# EAGLE design esp_LedControl_signal (EAGLE 9.5.2)
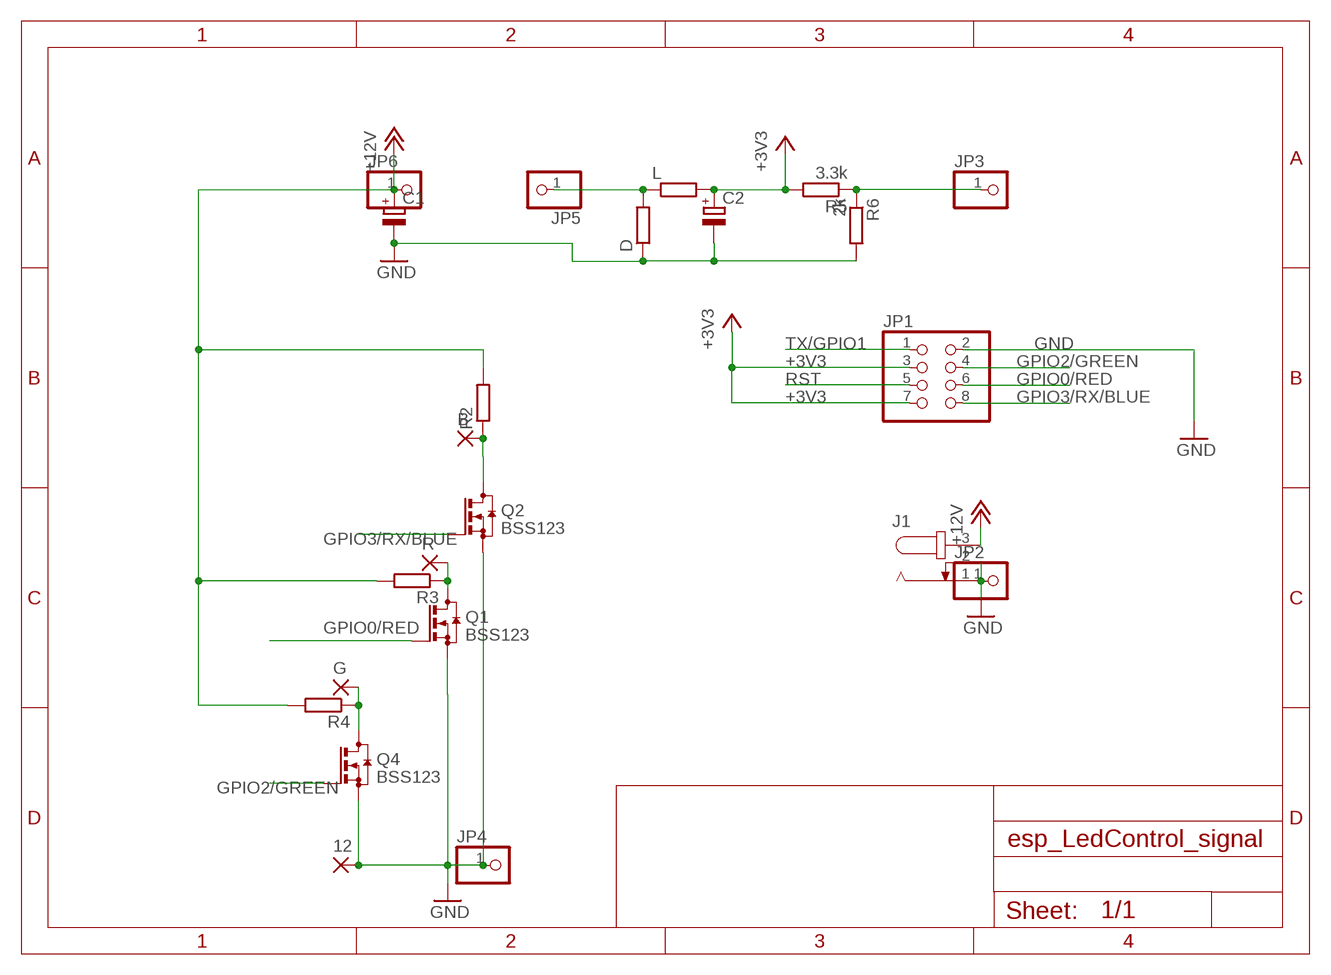
[diagram p0: schematic, sheet 1]

## Parts
12  3,17/1,3  [3,17/1,3]
B  3,17/1,3  [3,17/1,3]
C1  CPOL-EUE2.5-5  [E2,5-5]
C2  CPOL-EUE2.5-5  [E2,5-5]
D  R-EU_0204/7  [0204/7]
G  3,17/1,3  [3,17/1,3]
J1  JACK-PLUG0  [SPC4077]
JP1  PINHD-2X4  [2X04]
JP2  PINHD-1X1  [1X01]
JP3  PINHD-1X1  [1X01]
JP4  PINHD-1X1  [1X01]
JP5  PINHD-1X1  [1X01]
JP6  PINHD-1X1  [1X01]
L  R-EU_0204/7  [0204/7]
Q1  BSS123  [SOT23]
Q2  BSS123  [SOT23]
Q4  BSS123  [SOT23]
R  3,17/1,3  [3,17/1,3]
R2  R-EU_R0805  [R0805]
R3  R-EU_R0805  [R0805]
R4  R-EU_R0805  [R0805]
R5  3.3k  R-EU_R1206  [R1206]
R6  2k  R-EU_R1206  [R1206]

## Nets
+3V3: C2.+ JP1.3 JP1.7 L.2 R5.2
+12V: C1.+ J1.3 JP6.1 R2.2 R3.2 R4.2
GND: 12.1(P) C1.- C2.- D.1 J1.1 J1.2 JP1.2 JP2.1 JP4.1 Q1.2(S) Q2.2(S) Q4.2(S) R6.2
GPIO0/RED: JP1.6 Q1.1(G)
GPIO2/GREEN: JP1.4 Q4.1(G)
GPIO3/RX/BLUE: JP1.8 Q2.1(G)
N$1: G.1(P) Q4.3(D) R4.1
N$2: JP3.1 R5.1 R6.1
N$3: B.1(P) Q2.3(D) R2.1
N$4: D.2 JP5.1 L.1
N$10: Q1.3(D) R3.1 R.1(P)
RST: JP1.5
TX/GPIO1: JP1.1

## Library data of the parts
12 B G R = wirepad:3,17/1,3: THROUGH-HOLE PAD
C1 C2 = rcl:CPOL-EU: POLARIZED CAPACITOR, European symbol; SPICEPREFIX: C
D L R2-R6 = rcl:R-EU_: RESISTOR, European symbol; SPICEPREFIX: R
J1 = con-jack:JACK-PLUG: DC POWER JACK Power Jack, DC, Right Angle, Through Hole, Rated 5A at 16VDC, PC Terminals Distributor: Farnell (www.Farnell.de) Drawing: 84N1161.pdf / 84N1162.pdf Manufacturer: SPC Technology (www.spctechnology.com) Type: SPC4077 / SPC 4078; OC_FARNELL: unknown; OC_NEWARK: unknown
JP1 = pinhead:PINHD-2X4: PIN HEADER
JP2-JP6 = pinhead:PINHD-1X1: PIN HEADER
Q1 Q2 Q4 = transistor-small-signal:BSS123: N-CHANNEL MOS FET

## Net classes
0 default: clearance 0.205 mm

## Board
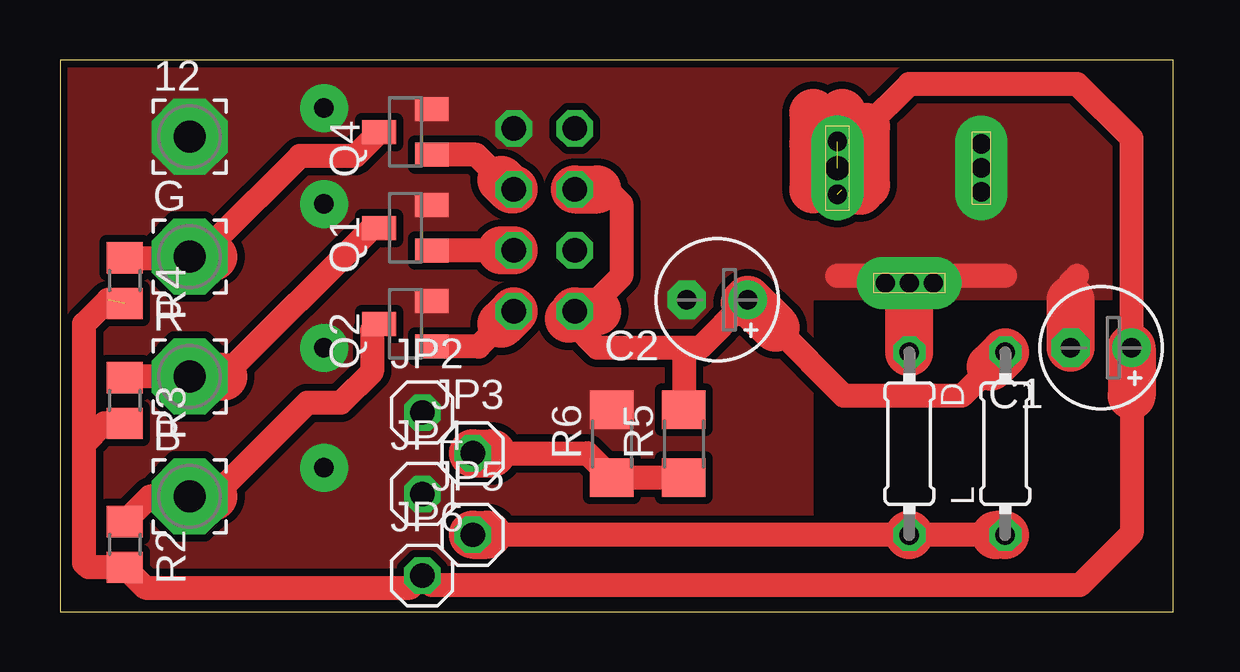
[diagram p1: board, top side]
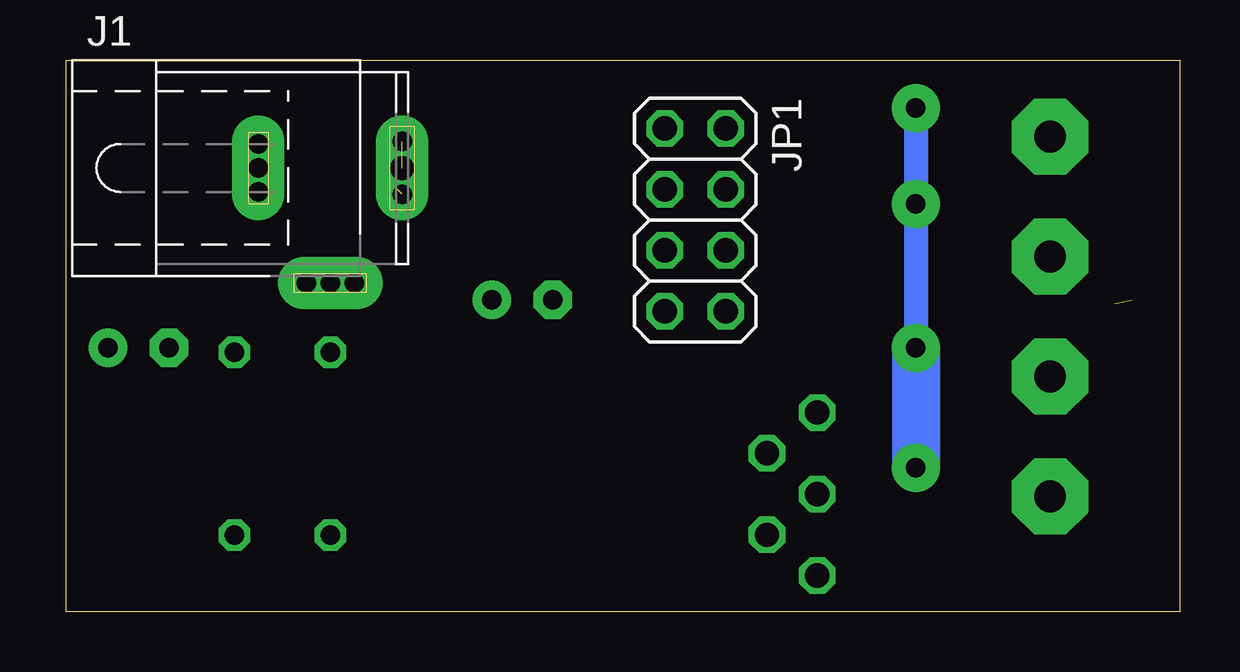
[diagram p2: board, bottom side, seen from below]

Size 46.4 x 23 mm. Coordinates in mm from the lower left corner, seen from the top.
Outline: 0,0 46.4,0 46.4,23 0,23 0,0
Copper layers (1*16): Top 0.035mm / dielectric 1.5mm / Bottom 0.035mm
Design rules "default *": minimum track width 6mil, minimum drill 0.35mm, track to track 6mil, track to pad 6mil, pad to pad 6mil, via to via 6mil, smd to smd 6mil, copper to edge 5mil, drill to drill 6mil, minimum pad ring 10mil, minimum via ring 8mil, stop-mask expansion 4mil, vias tented up to drill 0mil, thermal gap 10mil

### Footprints (pad centres in the part's own frame; a part is rotated, then mirrored left to right if it is on the bottom)
3,17/1,3 = drill 1.321 pad 3.175 octagon: 1 0,0
E2,5-5 = drill 0.813 pad 1.6: + -1.27,0 | drill 0.813 pad 1.6 octagon: - 1.27,0
0204/7 = drill 0.813 octagon: 1 -3.81,0; 2 3.81,0
SPC4077 = drill 0.8 pad 2.184 long: 1 -3,0; 2 0,-4.8 | drill 1 pad 2.184 long: 3 3,0
2X04 = drill 1.016 octagon: 1 -3.81,-1.27; 2 -3.81,1.27; 3 -1.27,-1.27; 4 -1.27,1.27; 5 1.27,-1.27; 6 1.27,1.27; 7 3.81,-1.27; 8 3.81,1.27
1X01 = drill 1.016 octagon: 1 0,0
SOT23 = smd 1 x 1.4: 1 -0.95,-1.1; 2 0.95,-1.1; 3 0,1.1
R0805 = smd 1.3 x 1.5: 1 -0.95,0; 2 0.95,0
R1206 = smd 1.6 x 1.803: 1 -1.422,0; 2 1.422,0

### Placement (x,y rotation side)
12  5.4,19.8 0 top
B  5.4,4.8 0 top
C1  43.4,11 180 top
C2  27.4,13 180 top
D  35.4,7 270 top
G  5.4,14.8 0 top
J1  35.4,18.5 0 bottom
JP1  20.19,16.33 270 bottom
JP2  15.1,8.3 0 top
JP3  17.2,6.6 0 top
JP4  15.1,4.9 0 top
JP5  17.2,3.2 0 top
JP6  15.1,1.5 0 top
L  39.4,7 90 top
Q1  14.4,16 90 top
Q2  14.4,12 90 top
Q4  14.4,20 90 top
R  5.4,9.8 0 top
R2  2.7,2.8 270 top
R3  2.7,8.8 270 top
R4  2.7,13.8 270 top
R5  26,7 90 top
R6  23,7 90 top

### Tracks (layer width: path | path; a pad name or v marks a point on that pad's centre or on a via)
+3V3
  Top 1: 22.4,17.6 22.8,17.6 23.4,17 23.4,14 21.92,12.52 JP1.7 | 28.54,12.87 26.67,11 26,11 | 26,11 22.4,11 21.46,11.94 21.46,12.46 | 38.8,10.21 37.59,9 32.67,9 29.84,11.84 | 26,11 R5.2
  Top 2: 22.4,12.52 JP1.7 21.46,12.46 21.2,12.2 | JP1.3 22.4,17.6 | 29.84,11.84 C2.+ 28.54,12.87 | L.2 38.8,10.21
+12V  (via drill 0.8)  (3 unrouted)
  Top 1: 33.6,20.2 35.4,22 42.4,22 44.67,19.73 C1.+ | 44.67,9 44.67,3.27 42.5,1.1 15.5,1.1 JP6.1 14.6,1 3.55,1 R2.2 1.18,1.85 1,2.03 1,7 | 1,7 1.85,7.85 R3.2 | 1,7 1,12 2,13
  Top 2: J1.3 32.4,17.8 32.6,17.6 | J1.3 32.4,20.6 32.6,20.8 | J1.3 33.35,17.55 33.6,17.8 33.6,20.2 | 31.4,20.8 31.4,19.5 | J1.3 31.4,19.5 | 31.4,19.5 31.4,17.6 | C1.+ 44.67,9
  other vias: 32.4,19.6 32.4,17.4
GND  (via drill 0.8, 0.8 pad 2)
  Top 1: 39.4,14 35.7,14 J1.2 | D.1 35.4,13 34.4,14 32.4,14 | 42.13,13 42.13,13.73 42.4,14
  Top 2: D.1 J1.2 | C1.- 42.13,13
  Bottom 1: v11,21 v11,17 v11,11
  Bottom 2: v11,11 v11,6
  other vias: 38.4,17.5 38.4,19.5 34.4,13.7 36.4,13.7
  pour Top (isolate 0.3, no thermals): 0,23 0,0 31.4,0 31.4,13 46.4,13 46.4,23
GPIO0/RED
  Top 1: 18.4,15.06 Q1.1
  Top 2: JP1.6 18.4,15.06
GPIO2/GREEN
  Top 1: Q4.1 17.35,19.05 18.4,18
  Top 2: JP1.4 18.8,17.6 18.4,18
GPIO3/RX/BLUE
  Top 1: 18.4,12 17.45,11.05 Q2.1
  Top 2: JP1.8 18.4,12
N$1
  Top 1: 6.4,14.8 6.4,15.4 10,19 12.3,19 13,19.7 Q4.3 | 5.2,15 G.1 5.35,14.75 R4.1
  Top 2: G.1 6.4,14.8
N$2
  Top 1: R5.1 R6.1 21.98,6.6 18,6.6
  Top 2: JP3.1 18,6.6
N$3
  Top 1: 6.4,4.8 10.3,8.7 11.7,8.7 13,10 13,11.7 Q2.3 | B.1 3.75,4.8 R2.1
  Top 2: B.1 6.4,4.8
N$4
  Top 1: D.2 17.8,3.2 | 39,3.19 D.2
  Top 2: JP5.1 17.8,3.2 | D.2 | L.1 39,3.19
N$10
  Top 1: 6.8,9.8 13,16 Q1.3 | 5.2,10 R.1 2.75,9.8 R3.1
  Top 2: R.1 6.8,9.8